# EasyEDA Pro project Dispenser Scale Feedback.eprj

# Schematic Schematic1
Board Name: Board1; Create Date: 2025-08-19; Page Name: P1; Project Name: Dispenser Scale Feedback; Schematic Name: Schematic1; Update Date: 2025-10-22; Company: EasyEDA.com; Page Size: A4; Version: V1.0
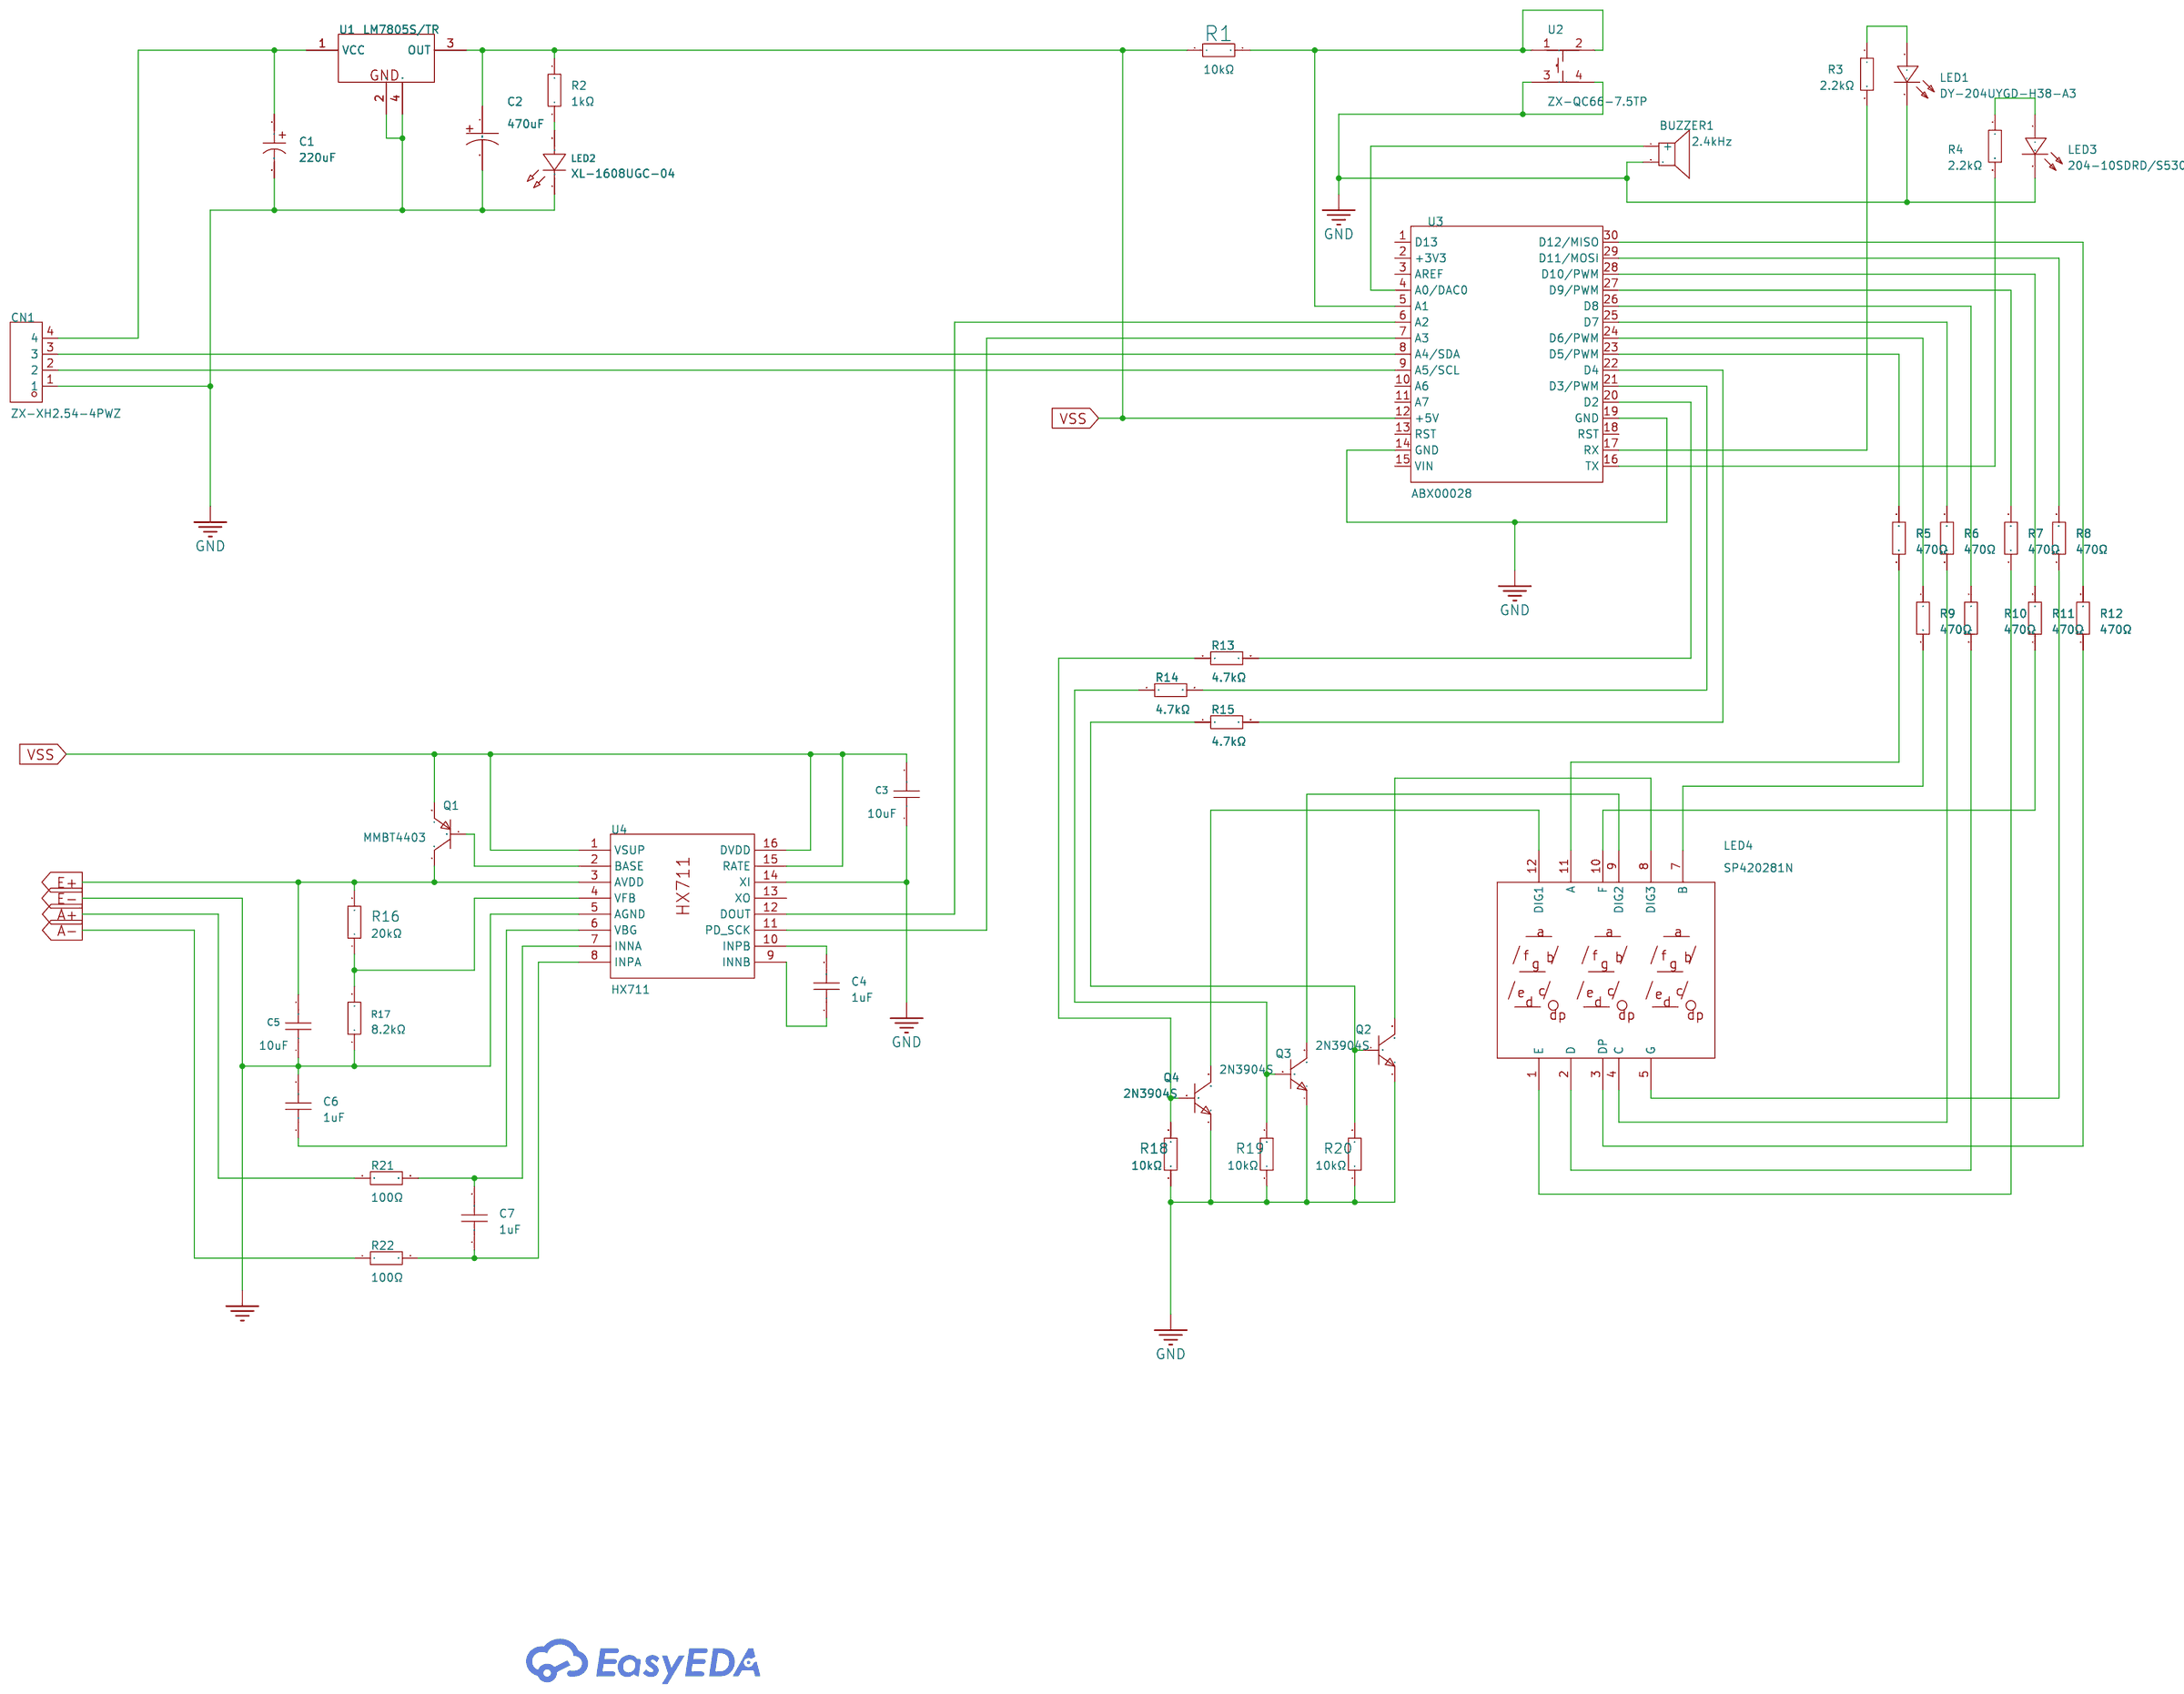
[diagram p0: schematic sheet]

## Parts
BUZZER1  2.4kHz  [BUZ-TH_BD12.0-P7.60-D0.6-FD]
C1  220uF  [CAP-SMD_BD6.3-L6.6-W6.6-LS7.4-FD]
C2  470uF  [CAP-SMD_BD6.3-L6.6-W6.6-FD]
C3  10uF  [C0603]
C4  1uF  [C0603]
C5  10uF  [C0603]
C6  1uF  [C0603]
C7  1uF  [C0603]
CN1  ZX-XH2.54-4PWZ  [CONN-TH_4P-P2.50_ZX-XH2.54-4PWZ]
LED1  DY-204UYGD-H38-A3  [LED-TH_BD4.0-P2.54-FD]
LED2  XL-1608UGC-04  [LED0603-RD_GREEN]
LED3  204-10SDRD/S530-A3/F182-68  [LED-TH_BD4.0-P2.54-FD]
LED4  SP420281N  [LED-SEG-TH_SP420281N]
Q1  MMBT4403  [SOT-23-3_L2.9-W1.3-P1.90-LS2.4-BR]
Q2  2N3904S  [SOT-23-3_L2.9-W1.3-P1.90-LS2.4-TR]
Q3  2N3904S  [SOT-23-3_L2.9-W1.3-P1.90-LS2.4-TR]
Q4  2N3904S  [SOT-23-3_L2.9-W1.3-P1.90-LS2.4-TR]
R1  10kΩ  [R0603]
R2  1kΩ  [R0603]
R3  2.2kΩ  [R0603]
R4  2.2kΩ  [R0603]
R5  470Ω  [R0603]
R6  470Ω  [R0603]
R7  470Ω  [R0603]
R8  470Ω  [R0603]
R9  470Ω  [R0603]
R10  470Ω  [R0603]
R11  470Ω  [R0603]
R12  470Ω  [R0603]
R13  4.7kΩ  [R0603]
R14  4.7kΩ  [R0603]
R15  4.7kΩ  [R0603]
R16  20kΩ  [R0603]
R17  8.2kΩ  [R0603]
R18  10kΩ  [R0603]
R19  10kΩ  [R0603]
R20  10kΩ  [R0603]
R21  100Ω  [R0603]
R22  100Ω  [R0603]
U1  LM7805S/TR  [TO-263-3_L8.6-W10.2-P2.54-LS14.4-BR]
U2  ZX-QC66-7.5TP  [KEY-SMD_4P-L6.0-W6.0-P4.50-LS8.6]
U3  ABX00028  [MOD-TH_ABX00028]
U4  HX711  [SOP-16_L10.0-W3.9-P1.27-LS6.0-BL]

## Library data of the parts
BUZZER1 = TMB12A05: Driver Circuitry:Active (Built-in Driver Circuit) Technology:Electromagnetic Type Voltage Rating:- Voltage - Supply:4V~8V Voltage - Supply:4V~8V Frequency:2.4kHz Current Consumption:- Sound Pressure Level(SPL):85dB Diameter(φD):12mm Length:- Width:- Heigh; Supplier Part: C96093; Manufacturer: 华能; Supplier Footprint: 插件,D=12mm; JLCPCB Part Class: Extended Part; Datasheet: https://atta.szlcsc.com/upload/public/pdf/source/20241025/8A17FE04D767D19A35A06DEF9A82AB1E.pdf; Supplier: LCSC; Driver Circuitry: Active (Built-in Driver Circuit); Technology: Electromagnetic Type; Voltage - Supply: 4V~8V; Sound Pressure Level(SPL): 85dB; Diameter(φD): 12mm; Height: 9.8mm
C1 = RVT1E221M0607: LCSC Part Name: 220uF ±20% 25V; Supplier Part: C2918361; Manufacturer: ROQANG(容强); Supplier Footprint: SMD,D6.3xL7.7mm; JLCPCB Part Class: Extended Part; Datasheet: https://atta.szlcsc.com/upload/public/pdf/source/20241024/87413EF5140CF44BEEEC408A2EAB4036.pdf; Supplier: LCSC; Tolerance: ±20%; Ripple Current: 150mA@120Hz; Operating Temperature: -40℃~+105℃
C2 = RVT1A471M0607_C335982: LCSC Part Name: 470uF ±20% 10V; Supplier Part: C335982; Manufacturer: ROQANG(容强); Manufacturer Part: RVT1A471M0607; Supplier Footprint: SMD,D6.3xL7.7mm; JLCPCB Part Class: Extended Part; Datasheet: https://item.szlcsc.com/datasheet/RVT1A471M0607/314095.html; Supplier: LCSC; Tolerance: ±20%; Voltage Rating: 10V; Ripple Current: 200mA@120Hz; Diameter: 6.3mm; Height - Seated (Max): 7.7mm; Lifetime: 2000hrs@105℃; Operating Temperature: -40℃~+105℃
C3 C5 = CL10A106MQ8NNNC: Capacitance: Tolerance:±20% Tolerance:±20% Voltage Rated: Temperature Coefficient:; LCSC Part Name: 10uF ±20% 6.3V; Supplier Part: C1691; Manufacturer: SAMSUNG(三星); Supplier Footprint: 0603; JLCPCB Part Class: Extended Part; Datasheet: https://atta.szlcsc.com/upload/public/pdf/source/20160218/1457707763339.pdf; Supplier: LCSC; Tolerance: ±20%
C4 C6 C7 = CL10A105KB8NNNC: Capacitance:1uF Tolerance:±10% Tolerance:±10% Voltage Rating:50V Temperature Coefficient:X5R; LCSC Part Name: 1uF ±10% 50V; Supplier Part: C15849; Manufacturer: SAMSUNG(三星); Supplier Footprint: 0603; JLCPCB Part Class: Basic Part; Datasheet: https://item.szlcsc.com/datasheet/CL10A105KB8NNNC/16531.html; Supplier: LCSC; Tolerance: ±10%; Voltage Rating: 50V; Temperature Coefficient: X5R
CN1 = ZX-XH2.54-4PWZ: LCSC Part Name: 1x4P 间距:2.5mm 弯插 系列:XH; Supplier Part: C7429643; Manufacturer: Megastar(兆星); Supplier Footprint: 弯插,P=2.5mm; JLCPCB Part Class: Extended Part; Datasheet: https://item.szlcsc.com/datasheet/ZX-XH2.54-4PWZ/8427560.html; Supplier: LCSC; Pins Structure: 1x4P; Pitch: 2.5mm; Mounting Type: Right Angle; Reference Series: XH; Number of Pins: 4P; Number of Rows: 1; Number of PINs Per Row: 4; Current Rating: 3A; Contact Material: Brass; Contact Plating: Tin; Operating Temperature: -25℃~+85℃; Voltage Rating: 250V; Plastic Material: PA66; Flame Retardant Rating: UL94V-0; Color: White; Z-Height of the Board: 5.9mm; X-Length of Bottom Edge on Board (Spacing Line): 12.5mm; Y-Width of Bottom Edge on Board: 7.32mm
LED1 = DY-204UYGD-H38-A3: LCSC Part Name: 3mm圆头有边黄绿色; Supplier Part: C7470727; Manufacturer: TONYU(东裕); Supplier Footprint: D=3mm; JLCPCB Part Class: Extended Part; Datasheet: https://atta.szlcsc.com/upload/public/pdf/source/20230726/000EB079CD0A8C169FA94F7B667CD1E2.pdf; Supplier: LCSC
LED2 = XL-1608UGC-04: Lamp Holder Type:- Illumination Color:Emerald Green Voltage - Forward(Vf):3.3V Voltage - Forward(Vf):3.3V Power(Watts):70mW Forward Current:20mA Wavelength - Dominant:515nm~535nm Wavelength - Dominant:515nm~535nm Peak Wavelength:525nm Diode Configuration:; Supplier Part: C965804; Manufacturer: XINGLIGHT(成兴光); Supplier Footprint: 0603; JLCPCB Part Class: Extended Part; Datasheet: https://atta.szlcsc.com/upload/public/pdf/source/20250225/C314F1E3DD818220782E352D4A9DC75E.pdf; Supplier: LCSC; Illumination Color: Emerald Green; Voltage - Forward(Vf): 3.3V; Power(Watts): 70mW; Forward Current: 20mA; Wavelength - Dominant: 515nm~535nm; Peak Wavelength: 525nm; Diode Configuration: Discrete Diode; Lens Color: Water Clear; Luminous Intensity: 810mcd; Viewing Angle: 120°; Mounting Style: op View Mount; Check: true
LED3 = 204-10SDRD/S530-A3/F182-68: Supplier Part: C473831; Manufacturer: EVERLIGHT(亿光); Supplier Footprint: 插件; JLCPCB Part Class: Extended Part; Supplier: LCSC
LED4 = SP420281N: Number of Characters:3 Digit/Alpha Size(inch):0.28 Illumination Color:Red LED Polarity:Common Cathode; LCSC Part Name: 3位0.28英寸红色数码管 共阴极; Supplier Part: C122944; Manufacturer: ARKLED(方舟); Supplier Footprint: 插件; JLCPCB Part Class: Extended Part; Datasheet: https://item.szlcsc.com/datasheet/SP420281N/124214.html; Supplier: LCSC; Number of Characters: 3; Digit/Alpha Size(inch): 0.28; Illumination Color: Red; LED Polarity: Common Cathode
Q1 = MMBT4403_C727134: type:PNP Current - Collector(Ic):600mA Collector - Emitter Voltage VCEO:40V Pd - Power Dissipation:300mW DC Current Gain:100@150mA,2V DC Current Gain:100@150mA,2V Transition frequency(fT):200MHz Current - Collector Cutoff:100nA Vce Saturation(VCE(sat)):40; LCSC Part Name: hfe=100~300; Supplier Part: C727134; Manufacturer: TWGMC(台湾迪嘉); Supplier Footprint: SMDSOT-233P; JLCPCB Part Class: Extended Part; Datasheet: https://item.szlcsc.com/datasheet/MMBT4403/774239.html; Supplier: LCSC; type: PNP; Current - Collector(Ic): 600mA; Collector - Emitter Voltage VCEO: 40V; Pd - Power Dissipation: 300mW; DC Current Gain: 100@150mA,2V; Transition frequency(fT): 200MHz; Current - Collector Cutoff: 100nA; Vce Saturation(VCE(sat)): 400mV; Operating Temperature: -55℃~+150℃
Q2-Q4 = 2N3904S-RTK/PS_C18536: type:NPN Current - Collector(Ic):200mA Collector - Emitter Voltage VCEO:40V Pd - Power Dissipation:350mW DC Current Gain:100@10mA,1V DC Current Gain:100@10mA,1V Transition frequency(fT):300MHz Current - Collector Cutoff:- Vce Saturation(VCE(sat)):300mV Op; LCSC Part Name: 2N3904S-RTK/PS; Supplier Part: C18536; Manufacturer: KEC; Supplier Footprint: SOT-23; JLCPCB Part Class: Extended Part; Datasheet: https://item.szlcsc.com/datasheet/2N3904S-RTK%252FPS/19236.html; Supplier: LCSC; type: NPN; Current - Collector(Ic): 200mA; Collector - Emitter Voltage VCEO: 40V; Pd - Power Dissipation: 350mW; DC Current Gain: 100@10mA,1V; Transition frequency(fT): 300MHz; Vce Saturation(VCE(sat)): 300mV
R1 R18-R20 = 0603WAF1002T5E: Type:Thick Film Resistor Resistance:10kΩ Tolerance:±1% Tolerance:±1% Power(Watts):100mW Voltage-Supply(Max):75V Temperature Coefficient:±100ppm/℃ Temperature Coefficient:±100ppm/℃ Operating Temperature:-55℃~+155℃ Operating Temperature:-55℃~+155℃; LCSC Part Name: 厚膜电阻 10kΩ ±1% 100mW; Supplier Part: C25804; Manufacturer: UNI-ROYAL(厚声); Supplier Footprint: 0603; JLCPCB Part Class: Basic Part; Datasheet: https://item.szlcsc.com/datasheet/0603WAF1002T5E/26547.html; Supplier: LCSC; Type: Thick Film Resistor; Tolerance: ±1%; Power(Watts): 100mW; Voltage-Supply(Max): 75V; Temperature Coefficient: ±100ppm/℃; Operating Temperature: -55℃~+155℃
R2 = 0603WAF1001T5E: Type:Thick Film Resistors Resistance:1kΩ Tolerance:±1% Tolerance:±1% Power(Watts): Overload Voltage (Max): Temperature Coefficient:±100ppm/℃ Temperature Coefficient:±100ppm/℃ Operating Temperature Range:-55℃~+155℃ Operating Temperature Range:-55℃~+155℃; LCSC Part Name: 1kΩ ±1% 100mW 厚膜电阻; Supplier Part: C21190; Manufacturer: UNI-ROYAL(厚声); Supplier Footprint: 0603; JLCPCB Part Class: Basic Part; Datasheet: https://atta.szlcsc.com/upload/public/pdf/source/20200306/C422600_1E6D84923E4A46A82E41ADD87F860B5C.pdf; Supplier: LCSC; Type: Thick Film Resistors; Tolerance: ±1%; Temperature Coefficient: ±100ppm/℃; Operating Temperature Range: -55℃~+155℃; Check: true
R3 R4 = 0603WAF2201T5E_C4190: LCSC Part Name: 2.2kΩ ±1% 100mW 厚膜电阻; Supplier Part: C4190; Manufacturer: UNI-ROYAL(厚声); Manufacturer Part: 0603WAF2201T5E; Supplier Footprint: 0603; JLCPCB Part Class: Basic Part; Datasheet: https://atta.szlcsc.com/upload/public/pdf/source/20200306/C422600_1E6D84923E4A46A82E41ADD87F860B5C.pdf; Supplier: LCSC; Type: Thick Film Resistors; Tolerance: ±1%; Temperature Coefficient: ±100ppm/℃; Operating Temperature Range: -55℃~+155℃
R5-R12 = 0603WAF4700T5E: Type:Thick Film Resistor Resistance:470Ω Tolerance:±1% Tolerance:±1% Power(Watts):100mW Voltage-Supply(Max):75V Temperature Coefficient:±100ppm/℃ Temperature Coefficient:±100ppm/℃ Operating Temperature:-55℃~+155℃ Operating Temperature:-55℃~+155℃; LCSC Part Name: 470Ω ±1% 100mW 厚膜电阻; Supplier Part: C23179; Manufacturer: UNI-ROYAL(厚声); Supplier Footprint: 0603; JLCPCB Part Class: Basic Part; Datasheet: https://item.szlcsc.com/datasheet/0603WAF4700T5E/23906.html; Supplier: LCSC; Type: Thick Film Resistor; Tolerance: ±1%; Power(Watts): 100mW; Voltage-Supply(Max): 75V; Temperature Coefficient: ±100ppm/℃; Operating Temperature: -55℃~+155℃
R13-R15 = 0603WAF4701T5E: Type:Thick Film Resistor Resistance:4.7kΩ Tolerance:±1% Tolerance:±1% Power(Watts):100mW Voltage-Supply(Max):75V Temperature Coefficient:±100ppm/℃ Temperature Coefficient:±100ppm/℃ Operating Temperature:-55℃~+155℃ Operating Temperature:-55℃~+155℃; LCSC Part Name: 4.7kΩ ±1% 100mW 厚膜电阻; Supplier Part: C23162; Manufacturer: UNI-ROYAL(厚声); Supplier Footprint: 0603; JLCPCB Part Class: Basic Part; Datasheet: https://item.szlcsc.com/datasheet/0603WAF4701T5E/23889.html; Supplier: LCSC; Type: Thick Film Resistor; Tolerance: ±1%; Power(Watts): 100mW; Voltage-Supply(Max): 75V; Temperature Coefficient: ±100ppm/℃; Operating Temperature: -55℃~+155℃
R16 = 0603WAF2002T5E: Type:Thick Film Resistor Resistance:20kΩ Tolerance:±1% Tolerance:±1% Power(Watts):100mW Voltage-Supply(Max):75V Temperature Coefficient:±100ppm/℃ Temperature Coefficient:±100ppm/℃ Operating Temperature:-55℃~+155℃ Operating Temperature:-55℃~+155℃; LCSC Part Name: 20kΩ ±1% 100mW 厚膜电阻; Supplier Part: C4184; Manufacturer: UNI-ROYAL(厚声); Supplier Footprint: 0603; JLCPCB Part Class: Basic Part; Datasheet: https://item.szlcsc.com/datasheet/0603WAF2002T5E/4591.html; Supplier: LCSC; Type: Thick Film Resistor; Tolerance: ±1%; Power(Watts): 100mW; Voltage-Supply(Max): 75V; Temperature Coefficient: ±100ppm/℃; Operating Temperature: -55℃~+155℃
R17 = 0603WAF8201T5E: Type:Thick Film Resistor Resistance:8.2kΩ Tolerance:±1% Tolerance:±1% Power(Watts):100mW Voltage-Supply(Max):75V Temperature Coefficient:±100ppm/℃ Temperature Coefficient:±100ppm/℃ Operating Temperature:-55℃~+155℃ Operating Temperature:-55℃~+155℃; LCSC Part Name: 8.2kΩ ±1% 100mW 厚膜电阻; Supplier Part: C25981; Manufacturer: UNI-ROYAL(厚声); Supplier Footprint: 0603; JLCPCB Part Class: Basic Part; Datasheet: https://item.szlcsc.com/datasheet/0603WAF8201T5E/26724.html; Supplier: LCSC; Type: Thick Film Resistor; Tolerance: ±1%; Power(Watts): 100mW; Voltage-Supply(Max): 75V; Temperature Coefficient: ±100ppm/℃; Operating Temperature: -55℃~+155℃
R21 R22 = 0603WAF1000T5E: Type:Thick Film Resistors Resistance: Tolerance:±1% Tolerance:±1% Power(Watts): Overload Voltage (Max): Temperature Coefficient:±200ppm/℃ Temperature Coefficient:±200ppm/℃ Operating Temperature Range:-55℃~+155℃ Operating Temperature Range:-55℃~+155℃; LCSC Part Name: 100Ω ±1% 100mW 厚膜电阻; Supplier Part: C22775; Manufacturer: UNI-ROYAL(厚声); Supplier Footprint: 0603; JLCPCB Part Class: Basic Part; Datasheet: https://atta.szlcsc.com/upload/public/pdf/source/20200306/C422600_1E6D84923E4A46A82E41ADD87F860B5C.pdf; Supplier: LCSC; Type: Thick Film Resistors; Tolerance: ±1%; Temperature Coefficient: ±200ppm/℃; Operating Temperature Range: -55℃~+155℃
U1 = LM7805S/TR: LCSC Part Name: 固定电压稳压器; Supplier Part: C507146; Manufacturer: HGSEMI(华冠); Supplier Footprint: TO-263-3; JLCPCB Part Class: Extended Part; Datasheet: https://atta.szlcsc.com/upload/public/pdf/source/20211101/54C90BF39C07253AC431AF453924CB99.pdf; Supplier: LCSC
U2 = ZX-QC66-7.5TP: Circuit:SPST Actuator Style:Round Button Operating Force:260gf Mounting Style:Standing paste Switch Length:6mm Switch Width:6mm Switch Height:7.5mm Strike Gundam:Without bracket Contact Current:50mA Voltage Rating:12V Actuator/Cap Color:Black Pin Style:Gu; LCSC Part Name: 6*6*7.5贴片; Supplier Part: C7470157; Manufacturer: Megastar(兆星); Supplier Footprint: SMD; JLCPCB Part Class: Extended Part; Datasheet: https://atta.szlcsc.com/upload/public/pdf/source/20230724/17F4CEFE0A162643ACB441DBA4F7279A.pdf; Supplier: LCSC; Circuit: SPST; Actuator Style: Round Button; Operating Force: 260gf; Mounting Style: Standing paste; Switch Length: 6mm; Switch Width: 6mm; Switch Height: 7.5mm; Strike Gundam: Without bracket; Contact Current: 50mA; Voltage Rating: 12V; Actuator/Cap Color: Black; Pin Style: Gullwing; Mechanical Life: 100000 Times; Operating Temperature: -30℃~+80℃
U3 = ABX00028: Supplier Part: C21303176; Manufacturer: arduino; JLCPCB Part Class: Extended Part; Datasheet: https://item.szlcsc.com/datasheet/ABX00028/22723606.html; Supplier: LCSC
U4 = HX711: Resolution(Bits):24Bit Sampling Rate:10Hz number of channels:2 Voltage - Supply:2.6V~5.5V Voltage - Supply:2.6V~5.5V differential input:- Integral non - linearity:- Integral non - linearity:- Operating Temperature:-40℃~+85℃ Operating Temperature:-40℃~+85℃; Supplier Part: C43656; Manufacturer: AVIA(海芯科技); Supplier Footprint: SOP-16; JLCPCB Part Class: Extended Part; Datasheet: https://item.szlcsc.com/datasheet/HX711/44649.html; Supplier: LCSC; Resolution(Bits): 24Bit; Sampling Rate: 10Hz; number of channels: 2; Voltage - Supply: 2.6V~5.5V; Operating Temperature: -40℃~+85℃

## Nets
GND: BUZZER1.2 C1.2 C2.2 C3.1 CN1.1 LED1.2(K) LED2.1(K) LED3.2(K) Q2.1(E) Q3.1(E) Q4.1(E) R18.1 R19.1 R20.1 U1.2(GND) U1.4(GND) U2.3 U2.4 U3.14(GND) U3.19(GND) U4.14(XI)
VSS: C2.1 C3.2 Q1.2(E) R1.1 R2.2 U1.3(OUT) U3.12(+5V) U4.1(VSUP) U4.15(RATE) U4.16(DVDD)
A+: R21.1
A-: R22.1
E+: C5.2 Q1.3(C) R16.2 U4.3(AVDD)
E-: C5.1 C6.2 R17.1 U4.5(AGND)
VS: C1.1 CN1.4 U1.1(VCC)
$1N967: LED2.2(A) R2.1
$1N1205: Q1.1(B) U4.2(BASE)
$1N1599: R16.1 R17.2 U4.4(VFB)
$1N2218: C6.1 U4.6(VBG)
$1N2304: C7.2 R21.2 U4.7(INNA)
$1N2313: C7.1 R22.2 U4.8(INPA)
$1N4620: R14.2 U3.21(D3/PWM)
$1N4626: R15.2 U3.22(D4)
$1N4642: R5.2 U3.23(D5/PWM)
$1N4650: R9.1 U3.24(D6/PWM)
$1N4661: R6.2 U3.25(D7)
$1N4667: R10.1 U3.26(D8)
$1N4678: R7.2 U3.27(D9/PWM)
$1N4721: R11.2 U3.28(D10/PWM)
$1N4732: R8.2 U3.29(D11/MOSI)
$1N4885: R1.2 U2.1 U2.2 U3.5(A1)
$1N4974: BUZZER1.1(+) U3.4(A0/DAC0)
$1N5101: U3.6(A2) U4.12(DOUT)
$1N5127: U3.7(A3) U4.11(PD_SCK)
$1N7646: R13.2 U3.20(D2)
$1N8802: R12.2 U3.30(D12/MISO)
$1N11763: LED4.11(A) R5.1
$1N11767: LED4.7(B) R9.2
$1N11772: LED4.4(C) R6.1
$1N11776: LED4.2(D) R10.2
$1N11788: LED4.3(DP) R12.1
$1N15575: Q2.2(B) R15.1 R20.2
$1N15580: Q3.2(B) R14.1 R19.2
$1N15831: LED4.12(DIG1) Q4.3(C)
$1N16085: Q4.2(B) R13.1 R18.2
$1N16309: LED4.8(DIG3) Q2.3(C)
$1N16315: LED4.9(DIG2) Q3.3(C)
$1N16422: LED4.1(E) R7.1
$1N16441: LED4.10(F) R11.1
$1N16454: LED4.5(G) R8.1
$1N16761: LED1.1(A) R3.1
$1N16767: LED3.1(A) R4.1
$1N16816: R3.2 U3.17(RX)
$1N16821: R4.2 U3.16(TX)
$1N30110: CN1.2 U3.9(A5/SCL)
$1N30116: CN1.3 U3.8(A4/SDA)
$1N34795: C4.2 U4.10(INPB)
$1N34800: C4.1 U4.9(INNB)

Not connected (* = marked no-connect by the designer): U3 1(D13) 2(+3V3) 3(AREF) 10(A6) 11(A7) 13(RST) 15(VIN) 18(RST); U4 13(XO)

# Board PCB1
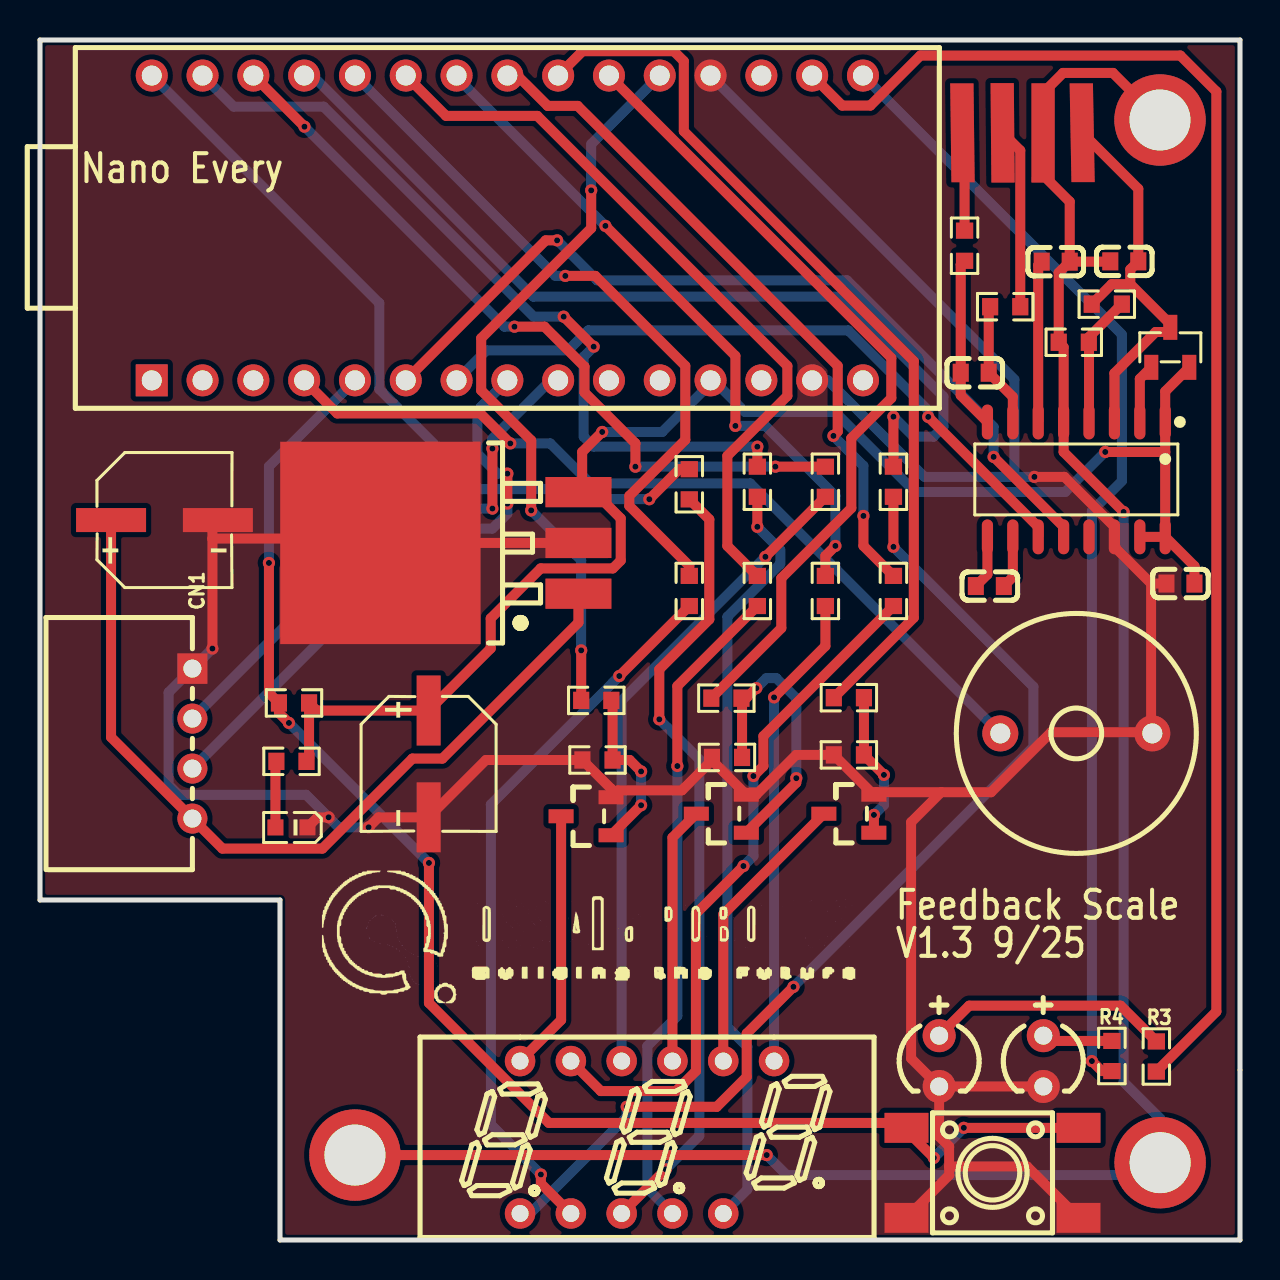
[diagram p1: board, top side]
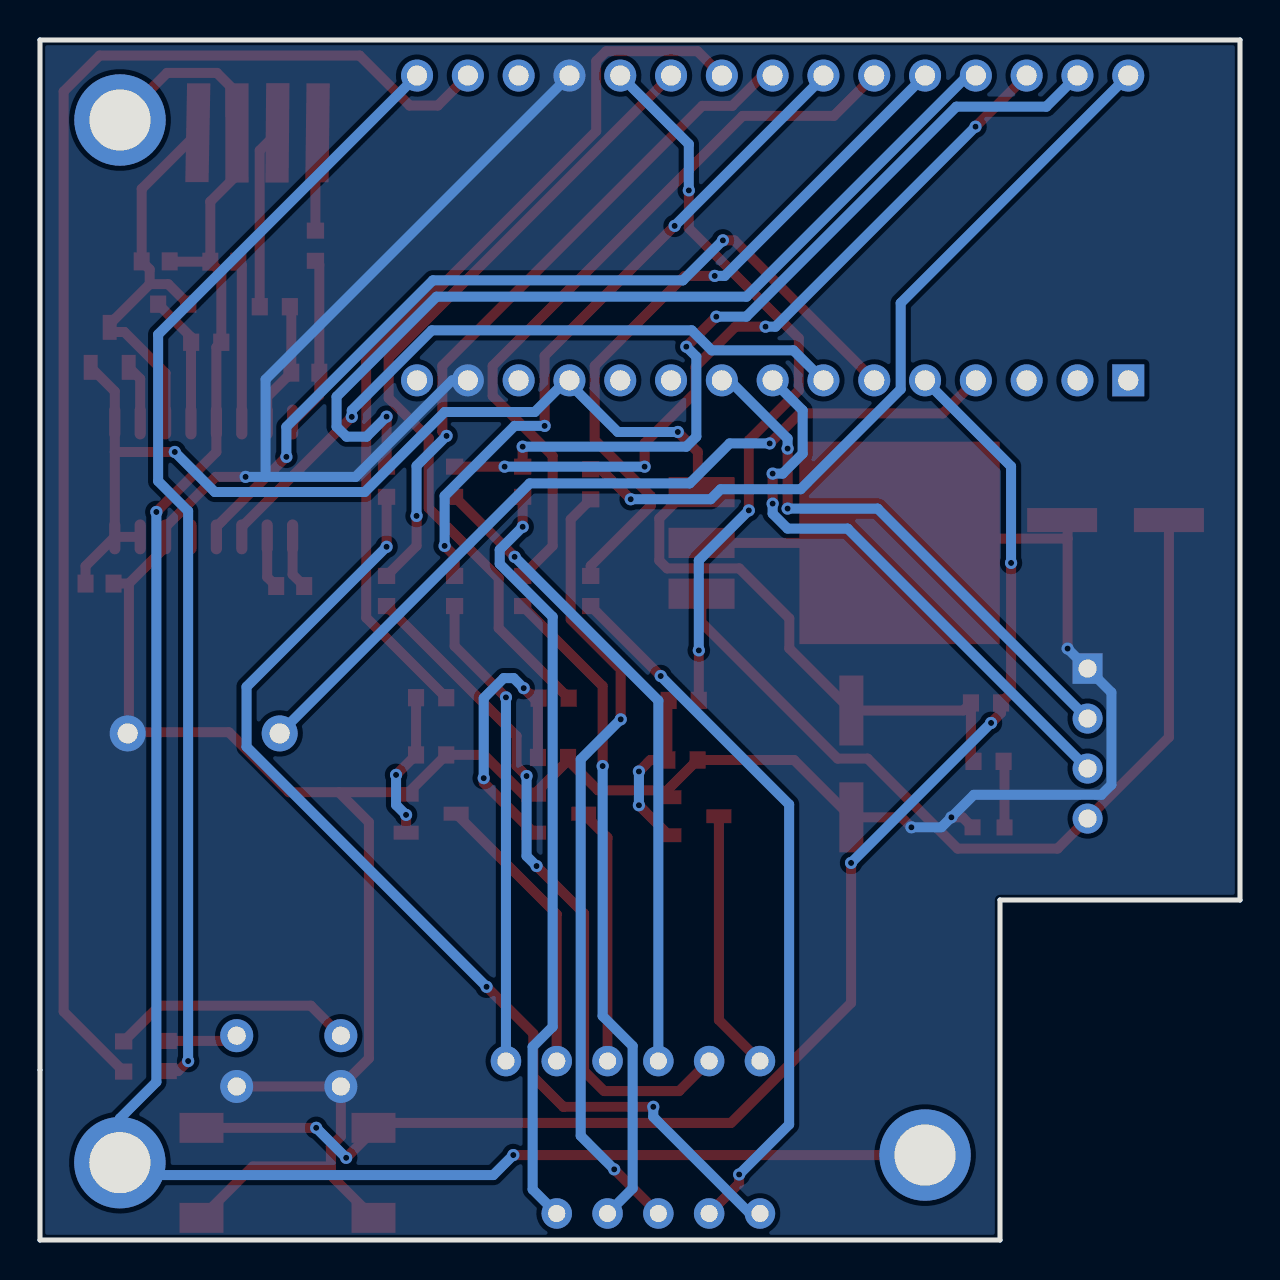
[diagram p2: board, bottom side, seen from below]

Outline 60 x 60 mm; copper layers: Top Layer, Bottom Layer. Coordinates in mm from the lower left corner of the outline.
Outline path: 0,60 0,17 12,17 12,0 60,0 60,60 0,60
Stack: Top Layer 0.035mm / Dielectric1 1.51mm FR4 er 4.5 / Bottom Layer 0.035mm

## Design rules (mm)
template: Custom Config
spacing copperThickness1oz (default): track to track 0.102, other pairs 0.152 to 0.3
spacing copperThickness2oz: track to track 0.203, other pairs 0.152 to 0.3
track width copperThickness1oz (default): min 0.5, default 0.5, max 2.54
track width copperThickness2oz: min 0.203, default 0.254, max 2.54
differential pair differentialPair (default): width min 0.127, default 0.254, max 2.54; gap min 0.152, default 0.152
via viaSize (default): diameter min 0.6, default 0.61, max 10; hole min 0.3, default 0.305, max 6.3

## Placement (name value [footprint] x y rotation side)
BUZZER1  2.4kHz  [BUZ-TH_BD12.0-P7.60-D0.6-FD]  51.82 25.33 0 top
C1  220uF  [CAP-SMD_BD6.3-L6.6-W6.6-LS7.4-FD]  6.22 36 0 top
C2  470uF  [CAP-SMD_BD6.3-L6.6-W6.6-FD]  19.43 23.81 270 top
C3  10uF  [C0603]  57.02 32.82 0 top
C4  1uF  [C0603]  47.49 32.7 0 top
C5  10uF  [C0603]  54.22 48.93 0 top
C6  1uF  [C0603]  50.79 48.92 0 top
C7  1uF  [C0603]  46.74 43.36 0 top
CN1  ZX-XH2.54-4PWZ  [CONN-TH_4P-P2.50_ZX-XH2.54-4PWZ]  7.62 24.82 270 top
LED1  DY-204UYGD-H38-A3  [LED-TH_BD4.0-P2.54-FD]  44.96 8.95 270 top
LED2  XL-1608UGC-04  [LED0603-RD_GREEN]  12.57 20.63 180 top
LED3  204-10SDRD/S530-A3/F182-68  [LED-TH_BD4.0-P2.54-FD]  50.16 8.95 270 top
LED4  SP420281N  [LED-SEG-TH_SP420281N]  30.35 5.14 0 top
NOREF  -  [Pad_e6]  56.01 3.87 0 top
NOREF#2  -  [Pad_e17]  15.75 4.25 0 top
NOREF#3  -  [Pad_e3673]  52.11 55.36 0 top
NOREF#4  -  [Pad_e3672]  50.15 55.35 0 top
NOREF#5  -  [Pad_e11]  56 56 0 top
NOREF#6  -  [Pad_e3670]  46.12 55.36 0 top
NOREF#7  -  [Pad_e3671]  48.13 55.36 0 top
Q1  MMBT4403  [SOT-23-3_L2.9-W1.3-P1.90-LS2.4-BR]  56.51 44.63 270 top
Q2  2N3904S  [SOT-23-3_L2.9-W1.3-P1.90-LS2.4-TR]  40.44 21.31 0 top
Q3  2N3904S  [SOT-23-3_L2.9-W1.3-P1.90-LS2.4-TR]  34.06 21.31 0 top
Q4  2N3904S  [SOT-23-3_L2.9-W1.3-P1.90-LS2.4-TR]  27.31 21.19 0 top
R1  10kΩ  [R0603]  12.7 26.85 180 top
R2  1kΩ  [R0603]  12.57 23.93 0 top
R3  2.2kΩ  [R0603]  55.82 9.18 270 top
R4  2.2kΩ  [R0603]  53.59 9.2 270 top
R5  470Ω  [R0603]  42.67 32.45 90 top
R6  470Ω  [R0603]  35.87 32.45 90 top
R7  470Ω  [R0603]  42.67 37.91 90 top
R8  470Ω  [R0603]  35.87 37.91 90 top
R9  470Ω  [R0603]  39.27 32.45 270 top
R10  470Ω  [R0603]  32.47 32.45 270 top
R11  470Ω  [R0603]  39.27 37.91 90 top
R12  470Ω  [R0603]  32.47 37.79 90 top
R13  4.7kΩ  [R0603]  27.81 26.98 180 top
R14  4.7kΩ  [R0603]  34.32 27.09 180 top
R15  4.7kΩ  [R0603]  40.44 27.12 180 top
R16  20kΩ  [R0603]  53.34 46.79 180 top
R17  8.2kΩ  [R0603]  51.69 44.89 0 top
R18  10kΩ  [R0603]  27.88 24 0 top
R19  10kΩ  [R0603]  34.35 24.13 0 top
R20  10kΩ  [R0603]  40.44 24.25 0 top
R21  100Ω  [R0603]  48.26 46.67 180 top
R22  100Ω  [R0603]  46.23 49.71 270 top
U1  LM7805S/TR  [TO-263-3_L8.6-W10.2-P2.54-LS14.4-BR]  21.97 34.85 0 top
U2  ZX-QC66-7.5TP  [KEY-SMD_4P-L6.0-W6.0-P4.50-LS8.6]  47.62 3.36 0 top
U3  ABX00028  [MOD-TH_ABX00028]  23.37 50.6 90 top
U4  HX711  [SOP-16_L10.0-W3.9-P1.27-LS6.0-BL]  51.82 38.03 180 top

## Footprints (pads in the part's own frame, mm; a bottom-side part is the same pattern mirrored in y, then rotated)
BUZ-TH_BD12.0-P7.60-D0.6-FD
  round 1.8 hole 1: 1(-3.8,0) 2(3.8,0)
C0603
  rect 0.8x0.9 smd: 1(-0.7,0) 2(0.7,0)
CAP-SMD_BD6.3-L6.6-W6.6-FD
  rect 3.5x1.2 smd: 1(-2.67,0) 2(2.67,0)
CAP-SMD_BD6.3-L6.6-W6.6-LS7.4-FD
  rect 3.5x1.2 smd: 1(-2.67,0) 2(2.67,0)
CONN-TH_4P-P2.50_ZX-XH2.54-4PWZ
  rect 1.524x1.5 hole 0.9: 1(-3.75,0)
  round 1.5 hole 0.9: 2(-1.25,0) 3(1.25,0) 4(3.75,0)
KEY-SMD_4P-L6.0-W6.0-P4.50-LS8.6
  rect 2.2x1.5 smd: 1(-4.3,2.25) 2(4.3,2.25) 3(-4.3,-2.25) 4(4.3,-2.25)
LED0603-RD_GREEN
  rect 0.8x0.8 smd: 1(-0.799,-0.004) 2(0.799,0.004)
LED-SEG-TH_SP420281N
  round 1.524 hole 0.85: 1(-6.35,-3.81) 2(-3.81,-3.81) 3(-1.27,-3.81) 4(1.27,-3.81) 5(3.81,-3.81) 7(6.35,3.81) 8(3.81,3.81) 9(1.27,3.81) 10(-1.27,3.81) 11(-3.81,3.81) 12(-6.35,3.81)
LED-TH_BD4.0-P2.54-FD
  round 1.651 hole 0.9: 1(-1.27,0) 2(1.27,0)
MOD-TH_ABX00028
  rect 1.6x1.6 hole 1: 1(-7.62,17.78)
  round 1.6 hole 1: 2(-7.62,15.24) 3(-7.62,12.7) 4(-7.62,10.16) 5(-7.62,7.62) 6(-7.62,5.08) 7(-7.62,2.54) 8(-7.62,0) 9(-7.62,-2.54) 10(-7.62,-5.08) 11(-7.62,-7.62) 12(-7.62,-10.16) 13(-7.62,-12.7) 14(-7.62,-15.24) 15(-7.62,-17.78) 16(7.62,-17.78) 17(7.62,-15.24) 18(7.62,-12.7) 19(7.62,-10.16) 20(7.62,-7.62) 21(7.62,-5.08) 22(7.62,-2.54) 23(7.62,0) 24(7.62,2.54) 25(7.62,5.08) 26(7.62,7.62) 27(7.62,10.16) 28(7.62,12.7) 29(7.62,15.24) 30(7.62,17.78)
Pad_e6
  round 4.572 hole 3.048: 1(0,0)
Pad_e11
  round 4.572 hole 3.048: 1(0,0)
Pad_e17
  round 4.572 hole 3.048: 1(0,0)
Pad_e3670
  custom 1.226x4.945 smd: 1(0,0)
Pad_e3671
  custom 1.209x4.972 smd: 1(0,0)
Pad_e3672
  custom 1.17x4.963 smd: 1(0,0)
Pad_e3673
  custom 1.256x4.941 smd: 1(0,0)
R0603
  rect 0.806x0.864 smd: 1(-0.753,0) 2(0.753,0)
SOP-16_L10.0-W3.9-P1.27-LS6.0-BL
  oval 0.56x1.745 smd: 1(-4.445,-2.873) 2(-3.175,-2.873) 3(-1.905,-2.873) 4(-0.635,-2.873) 5(0.635,-2.873) 6(1.905,-2.873) 7(3.175,-2.873) 8(4.445,-2.873) 9(4.445,2.873) 10(3.175,2.873) 11(1.905,2.873) 12(0.635,2.873) 13(-0.635,2.873) 14(-1.905,2.873) 15(-3.175,2.873) 16(-4.445,2.873)
SOT-23-3_L2.9-W1.3-P1.90-LS2.4-BR
  rect 1.25x0.7 smd: 1(1,-0.95) 2(1,0.95) 3(-1,0)
SOT-23-3_L2.9-W1.3-P1.90-LS2.4-TR
  rect 1.25x0.7 smd: 1(1.25,0.95) 2(1.25,-0.95) 3(-1.25,0)
TO-263-3_L8.6-W10.2-P2.54-LS14.4-BR
  rect 3.3x1.511 smd: 1(4.952,-2.54) 2(4.952,0) 3(4.952,2.54)
  rect 10.02x10.122 smd: 4(-4.952,0)

## Nets
As in the schematic, except:
A+: NOREF#7.1 R21.1
A-: NOREF#6.1 R22.1
E+: C5.2 NOREF#3.1 Q1.3 R16.2 U4.3
E-: C5.1 C6.2 NOREF.1 NOREF#2.1 NOREF#4.1 NOREF#5.1 R17.1 U4.5

Pads without a net: U3 1 2 3 10 11 13 15 18; U4 13

## Via types
v1: diameter 0.61, hole 0.305, Top Layer to Bottom Layer, 59 vias

## Routing (per net, layer and track width the routed paths; a pad name or vN(x,y) marks a point on that pad's centre or on a via; arc(x,y) is an arc through that point)
GND: length 183.7
  Top Layer w0.5: U2.4 49.36,3.68 45.46,3.68 ; 45.06,22.39 47.56,22.39 50.56,25.39 55.56,25.39 ; 45.06,22.39 41.82,22.39 ; 45.06,22.39 43.56,20.89 43.56,9.08 LED1.2 ; U1.2 U1.4 16.8,35.07 8.62,35.07 ; 41.82,22.39 41.69,22.26 ; 41.82,22.39 41.56,22.39 R20.1 37.81,24.25 35.81,22.26 Q3.1 33.6,23.98 ; C1.2 8.62,35.72 8.62,35.07 ; U2.3 45.46,3.24 45.46,3.68 ; 55.56,32.82 55.56,25.39 ; 55.56,32.82 53.72,34.66 U4.14 53.72,35.66 51.22,38.16 v1(49.72,38.16) ; 55.56,32.82 C3.1 ; 55.56,25.39 BUZZER1.2 ; 8.62,35.07 v1(8.62,29.57) ; 33.6,23.98 R19.1 ; 33.6,23.98 32.1,22.48 28.9,22.48 Q4.1 28.55,22.57 R18.1 22.3,24 C2.2 16.93,21.14 v1(16.43,20.64) ; LED1.2 44.96,5.18 45.46,4.68 45.46,3.68 ; LED1.2 LED3.2 ; LED2.1 13.87,21.14 v1(14.43,21.14)
  Bottom Layer w0.5: 48.72,38.16 48.72,43.03 U3.19 ; 48.72,38.16 44.22,38.16 39.4,42.98 U3.14 ; 48.72,38.16 v1(49.72,38.16) ; v1(16.43,20.64) 14.93,20.64 v1(14.43,21.14) 13.31,22.26 6.93,22.26 6.43,22.76 6.43,27.38 CN1.1 v1(8.62,29.57)
VSS: length 76.4
  Top Layer w0.5: U4.16 57.72,33.69 57.72,32.82 ; U4.16 56.26,39.4 ; U4.16 U4.15 ; 56.26,39.4 U4.1 56.26,42.43 Q1.2 ; 56.26,39.4 v1(53.26,39.4) ; v1(28.11,40.4) 27.11,39.4 27.11,37.58 ; R2.2 13.45,24.06 R1.1 13.83,26.47 C2.1 22.54,29.58 22.54,31.08 25.04,33.58 28.64,33.58 29.04,33.97 29.04,36.08 27.54,37.58 27.11,37.58 ; 27.11,37.58 U1.3
  Bottom Layer w0.5: 33.61,42.9 31.11,40.4 v1(28.11,40.4) ; 33.61,42.9 33.76,42.9 35.26,41.4 39.76,41.4 43.76,37.4 51.26,37.4 v1(53.26,39.4) ; 33.61,42.9 U3.12
A+: length 9.1
  Top Layer w0.5: R21.1 49.01,54.48 NOREF#7.1
A-: length 4.9
  Top Layer w0.5: NOREF#6.1 46.23,55.26 R22.1
E+: length 20.4
  Top Layer w0.5: NOREF#3.1 54.91,52.56 C5.2 54.51,48.53 54.51,47.79 ; 54.51,47.79 53.59,47.79 R16.2 ; 54.51,47.79 56.51,45.79 Q1.3 56.28,45.4 55.78,45.4 53.72,43.34 U4.3
E-: length 106.7
  Top Layer w0.5: C6.2 53.5,48.92 C5.1 ; C6.2 51.49,51.92 50.15,53.25 NOREF#4.1 50.15,57.35 51.15,58.35 53.65,58.35 NOREF#5.1 ; C6.2 50.94,48.37 R17.1 51.18,44.64 U4.5 51.18,39.4 v1(54.18,36.4) ; v1(36.34,4.25) NOREF#2.1
  Bottom Layer w0.5: v1(54.18,36.4) 54.18,7.9 56.01,6.08 56.01,4.08 ; 56.01,4.08 NOREF.1 ; 56.01,4.08 55.18,3.25 37.34,3.25 v1(36.34,4.25)
VS: length 42.7
  Top Layer w0.5: U1.1 26.92,30.87 20.12,24.07 18.62,24.07 14.12,19.57 9.12,19.57 CN1.4 3.55,25.14 C1.1
$1N967: length 3.3
  Top Layer w0.5: LED2.2 11.77,23.89 R2.1
$1N1205: length 3
  Top Layer w0.5: U4.2 54.99,43.06 Q1.1
$1N1599: length 6.6
  Top Layer w0.5: R16.1 52.44,45.14 R17.2 52.45,44.88 U4.4
$1N2218: length 8.1
  Top Layer w0.5: C6.1 49.91,48.74 U4.6
$1N2304: length 6.3
  Top Layer w0.5: U4.7 48.64,42.16 C7.2 47.44,46.59 R21.2
$1N2313: length 8.7
  Top Layer w0.5: U4.8 46.04,42.24 C7.1 46.04,48.77 R22.2
$1N4620: length 40.7
  Top Layer w0.5: U3.21 42.57,44.1 42.57,42.09 40.57,40.09 40.57,36.59 37.07,33.09 37.07,30.59 R14.2
$1N4626: length 45.2
  Top Layer w0.5: R15.2 43.69,31.12 43.69,43.94 32.19,55.44 32.19,58.94 31.69,59.44 27.13,59.44 U3.22
$1N4642: length 34.4
  Top Layer w0.5: U3.23 23.87,58.22 25.38,56.7 26.88,56.7 39.88,43.7 39.88,40.42 v1(39.67,40.2) ; R5.2 41.17,34.7 v1(41.17,36.2)
  Bottom Layer w0.5: v1(39.67,40.2) 41.17,38.7 v1(41.17,36.2)
$1N4650: length 33.9
  Top Layer w0.5: R9.1 39.27,34.2 v1(39.77,34.7) ; v1(34.77,40.7) 34.77,44.2 v1(28.27,50.7)
  Bottom Layer w0.5: v1(34.77,40.7) 36.27,40.7 39.77,37.2 v1(39.77,34.7) ; v1(28.27,50.7) 20.83,58.15 U3.24
$1N4661: length 37.5
  Top Layer w0.5: U3.25 20.31,56.2 24.87,56.2 37.37,43.7 37.37,42.2 34.37,39.2 34.37,34.7 R6.2
$1N4667: length 35.4
  Top Layer w0.5: R10.1 32.47,33.7 29.47,36.7 29.47,37.2 32.26,40 32.26,43.7 27.76,48.2 v1(26.26,48.2)
  Bottom Layer w0.5: v1(26.26,48.2) 25.76,48.2 U3.26
$1N4678: length 45.7
  Top Layer w0.5: R7.2 v1(42.67,41.17)
  Bottom Layer w0.5: v1(42.67,41.17) 43.67,40.17 44.67,40.17 45.17,40.67 45.17,42.17 40.17,47.17 24.67,47.17 13.62,58.22 U3.27
$1N4721: length 38.1
  Top Layer w0.5: v1(29.77,38.67) 29.77,39.84 27.22,42.38 27.22,43.67 25.22,45.67 v1(23.72,45.67) ; R11.2 v1(36.77,38.67) ; v1(13.22,55.67) U3.28
  Bottom Layer w0.5: v1(23.72,45.67) 23.22,45.67 v1(13.22,55.67) ; v1(36.77,38.67) v1(29.77,38.67)
$1N4732: length 39.8
  Top Layer w0.5: v1(27.68,44.67) v1(26.18,46.17) ; R8.2 v1(35.87,39.67)
  Bottom Layer w0.5: U3.29 9.68,56.67 14.18,56.67 24.68,46.17 v1(26.18,46.17) ; v1(27.68,44.67) 27.18,44.17 27.18,40.17 27.68,39.67 v1(35.87,39.67)
$1N4885: length 72.7
  Top Layer w0.5: v1(11.45,33.85) 11.45,27.35 R1.2 11.95,26.35 v1(12.45,25.85) ; 43.19,5.61 42.95,5.85 25.45,5.85 19.45,11.85 v1(19.45,18.85) ; 43.19,5.61 v1(44.69,4.11) ; 43.19,5.61 U2.1 ; v1(46.19,5.61) U2.2
  Bottom Layer w0.5: U3.5 11.45,38.68 v1(11.45,33.85) ; v1(44.69,4.11) v1(46.19,5.61) ; v1(12.45,25.85) v1(19.45,18.85)
$1N4974: length 42.1
  Top Layer w0.5: U3.4 14.86,41.33 22.02,41.33 v1(23.52,39.83)
  Bottom Layer w0.5: v1(23.52,39.83) 25.52,39.83 27.52,37.83 35.52,37.83 BUZZER1.1
$1N5101: length 43.1
  Top Layer w0.5: v1(25.86,49.98) 25.29,49.98 U3.6 ; v1(47.68,39.16) 51.18,35.66 U4.12
  Bottom Layer w0.5: v1(25.86,49.98) 27.86,47.98 40.36,47.98 47.68,40.66 v1(47.68,39.16)
$1N5127: length 34.9
  Top Layer w0.5: U4.11 49.91,35.66 v1(44.41,41.16)
  Bottom Layer w0.5: U3.7 22.33,44.48 26.41,44.48 27.41,45.48 40.41,45.48 44.41,41.48 v1(44.41,41.16)
$1N7646: length 37
  Top Layer w0.5: R13.2 v1(27.06,29.48) ; v1(24.56,36.48) 24.56,39.98 22.06,42.48 22.06,45.09 27.56,50.59 v1(27.56,52.48)
  Bottom Layer w0.5: v1(27.56,52.48) 27.56,54.79 U3.20 ; v1(24.56,36.48) 27.06,33.98 v1(27.06,29.48)
$1N8802: length 38.8
  Top Layer w0.5: v1(30.47,37.04) 31.97,38.54 R12.2
  Bottom Layer w0.5: v1(30.47,37.04) 26.47,37.04 25.97,37.54 21.97,37.54 16.97,42.54 16.97,46.84 U3.30
$1N11763: length 34.6
  Top Layer w0.5: LED4.11 28.04,7.45 31.79,7.45 32.79,8.45 32.79,16.32 v1(35.17,18.7) ; R5.1 36.17,25.2 36.17,23.7 v1(35.67,23.2)
  Bottom Layer w0.5: v1(35.17,18.7) 35.67,19.2 v1(35.67,23.2)
$1N11767: length 23.8
  Top Layer w0.5: R9.2 39.27,29.7 v1(36.7,27.13)
  Bottom Layer w0.5: v1(36.7,27.13) LED4.7
$1N11772: length 33.2
  Top Layer w0.5: R6.1 31.87,27.7 v1(31.87,23.7)
  Bottom Layer w0.5: LED4.4 30.37,2.58 30.37,9.7 31.87,11.2 v1(31.87,23.7)
$1N11776: length 36.1
  Top Layer w0.5: v1(25.04,3.28) 25.04,2.83 LED4.2 ; R10.2 v1(28.97,28.2)
  Bottom Layer w0.5: v1(25.04,3.28) 22.54,5.78 22.54,21.78 v1(28.97,28.2)
$1N11788: length 39.6
  Top Layer w0.5: R12.1 33.47,36.03 33.47,31.03 30.97,28.53 v1(30.97,26.03) ; v1(31.29,3.53) LED4.3
  Bottom Layer w0.5: v1(31.29,3.53) 32.97,5.21 32.97,24.03 v1(30.97,26.03)
$1N15575: length 7.4
  Top Layer w0.5: v1(41.7,21.25) 41.69,20.36 ; v1(42.2,23.25) R20.2 R15.1
  Bottom Layer w0.5: v1(42.2,23.25) 42.2,21.75 v1(41.7,21.25)
$1N15580: length 14.3
  Top Layer w0.5: v1(35.81,27.59) 35.31,27.09 R14.1 35.1,27.06 R19.2 ; Q3.2 37.81,22.86 v1(37.81,23.09)
  Bottom Layer w0.5: v1(37.81,23.09) 37.81,27.09 36.81,28.09 36.31,28.09 v1(35.81,27.59)
$1N15831: length 13.1
  Top Layer w0.5: Q4.3 26.06,11 LED4.12
$1N16085: length 8.5
  Top Layer w0.5: R13.1 28.63,26.92 R18.2 29.48,24 v1(30.05,23.43) ; v1(30.05,21.74) Q4.2
  Bottom Layer w0.5: v1(30.05,23.43) v1(30.05,21.74)
$1N16309: length 14.5
  Top Layer w0.5: Q2.3 34.16,16.28 LED4.8
$1N16315: length 12.9
  Top Layer w0.5: LED4.9 31.62,20.12 Q3.3
$1N16422: length 52.3
  Top Layer w0.5: v1(29.34,6.66) 33.84,6.66 35.34,8.16 35.34,10.32 v1(37.67,12.66) ; 42.67,37.16 v1(42.67,34.66)
  Bottom Layer w0.5: v1(42.67,34.66) 49.67,27.66 49.67,24.66 v1(37.67,12.66) ; v1(29.34,6.66) 29.34,6.16 24.5,1.33 LED4.1
$1N16441: length 32.4
  Top Layer w0.5: 39.27,37.16 v1(36.27,34.16)
  Bottom Layer w0.5: LED4.10 29.08,26.97 v1(36.27,34.16)
$1N16454: length 38.3
  Top Layer w0.5: 35.87,37.16 v1(35.87,35.66)
  Bottom Layer w0.5: v1(35.87,35.66) 37.01,34.51 37.01,33.81 34.37,31.16 34.37,10.66 35.37,9.66 35.37,2.53 LED4.5
$1N16761: length 12.2
  Top Layer w0.5: R3.1 54.03,11.72 46.46,11.72 LED1.1
$1N16767: length 3.5
  Top Layer w0.5: R4.1 50.43,9.95 LED3.1
$1N16816: length 72.9
  Top Layer w0.5: R3.2 58.82,11.42 58.82,57.42 57.02,59.22 44.02,59.22 41.52,56.72 40.11,56.72 U3.17
$1N16821: length 56.5
  Top Layer w0.5: v1(52.59,8.95) 53.09,8.45 R4.2
  Bottom Layer w0.5: v1(52.59,8.95) 52.59,36.45 54.09,37.95 54.09,45.28 U3.16
$1N30110: length 27.3
  Top Layer w0.5: v1(22.62,36.57) v1(22.62,39.57)
  Bottom Layer w0.5: U3.9 25.53,42.98 22.62,40.07 v1(22.62,39.57) ; v1(22.62,36.57) 18.12,36.57 CN1.2
$1N30116: length 29.2
  Top Layer w0.5: v1(23.37,36.82) v1(23.37,38.32)
  Bottom Layer w0.5: U3.8 21.87,41.48 21.87,39.32 22.87,38.32 v1(23.37,38.32) ; v1(23.37,36.82) 23.37,36.32 22.62,35.57 19.62,35.57 CN1.3
$1N34795: length 2.6
  Top Layer w0.5: C4.2 48.64,33.15 U4.10
$1N34800: length 2.7
  Top Layer w0.5: U4.9 47.37,33.28 C4.1

## Copper pours and planes (outline as drawn; the poured copper is in the pictures)
GND on Top Layer: 0,60 60.2,60 60.2,-0.2 0,-0.2
GND on Bottom Layer: 0,60 60.2,60 60.2,-0.2 0,-0.2

## Text on the board
Top Silkscreen Layer: Nano Every | Feedback Scale | V1.3 9/25
